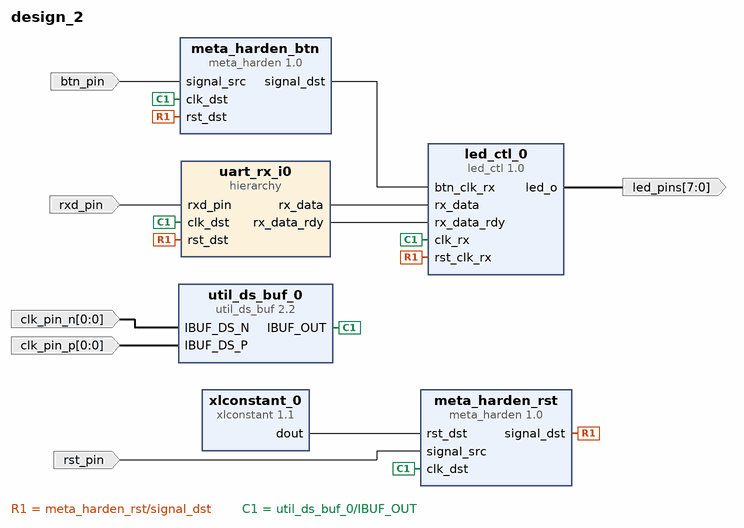
[diagram p0: block diagram of the top level]
# Vivado block design design_2, xcku040-ffva1156-2-e, Vivado 2021.2
create_bd_design design_2

create_bd_port -dir I -from 0 -to 0 -type clk clk_pin_p
create_bd_port -dir I -from 0 -to 0 -type clk clk_pin_n
create_bd_port -dir O -from 7 -to 0 led_pins
create_bd_port -dir I btn_pin
create_bd_port -dir I rst_pin
create_bd_port -dir I rxd_pin

create_bd_cell -type ip -vlnv xilinx.com:user:led_ctl:1.0 led_ctl_0
create_bd_cell -type ip -vlnv xilinx.com:user:meta_harden:1.0 meta_harden_btn
create_bd_cell -type ip -vlnv xilinx.com:user:meta_harden:1.0 meta_harden_rst
create_bd_cell -type ip -vlnv xilinx.com:ip:util_ds_buf:2.2 util_ds_buf_0
create_bd_cell -type hier uart_rx_i0
create_bd_cell -type ip -vlnv xilinx.com:ip:xlconstant:1.1 xlconstant_0
set_property -dict {CONFIG.CONST_VAL 0} [get_bd_cells xlconstant_0]

# ---- hierarchy /uart_rx_i0 ----
current_bd_instance /uart_rx_i0
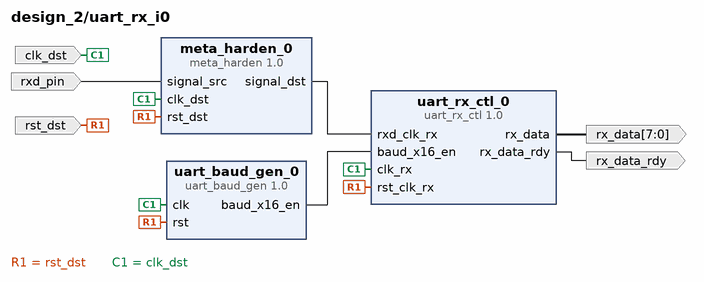
[diagram p1: block diagram inside /uart_rx_i0]
create_bd_pin -dir I clk_dst
create_bd_pin -dir I rst_dst
create_bd_pin -dir O -from 7 -to 0 rx_data
create_bd_pin -dir O rx_data_rdy
create_bd_pin -dir I rxd_pin

create_bd_cell -type ip -vlnv xilinx.com:user:uart_baud_gen:1.0 uart_baud_gen_0
create_bd_cell -type ip -vlnv xilinx.com:user:uart_rx_ctl:1.0 uart_rx_ctl_0
create_bd_cell -type ip -vlnv xilinx.com:user:meta_harden:1.0 meta_harden_0

# ---- connections ----

current_bd_instance /uart_rx_i0
connect_bd_net [get_bd_pins meta_harden_0/signal_dst] [get_bd_pins uart_rx_ctl_0/rxd_clk_rx]
connect_bd_net -net meta_harden_rst_signal_dst [get_bd_pins rst_dst] \
  [get_bd_pins meta_harden_0/rst_dst] [get_bd_pins uart_rx_ctl_0/rst_clk_rx] [get_bd_pins uart_baud_gen_0/rst]
connect_bd_net -net signal_src_0_3 [get_bd_pins rxd_pin] [get_bd_pins meta_harden_0/signal_src]
connect_bd_net [get_bd_pins uart_baud_gen_0/baud_x16_en] [get_bd_pins uart_rx_ctl_0/baud_x16_en]
connect_bd_net [get_bd_pins uart_rx_ctl_0/rx_data] [get_bd_pins rx_data]
connect_bd_net [get_bd_pins uart_rx_ctl_0/rx_data_rdy] [get_bd_pins rx_data_rdy]
connect_bd_net -net util_ds_buf_0_IBUF_OUT [get_bd_pins clk_dst] \
  [get_bd_pins meta_harden_0/clk_dst] [get_bd_pins uart_rx_ctl_0/clk_rx] [get_bd_pins uart_baud_gen_0/clk]

current_bd_instance /
connect_bd_net -net IBUF_DS_N_0_1 [get_bd_ports clk_pin_n] [get_bd_pins util_ds_buf_0/IBUF_DS_N]
connect_bd_net -net IBUF_DS_P_0_1 [get_bd_ports clk_pin_p] [get_bd_pins util_ds_buf_0/IBUF_DS_P]
connect_bd_net [get_bd_pins led_ctl_0/led_o] [get_bd_ports led_pins]
connect_bd_net [get_bd_pins meta_harden_btn/signal_dst] [get_bd_pins led_ctl_0/btn_clk_rx]
connect_bd_net [get_bd_pins meta_harden_rst/signal_dst] \
  [get_bd_pins meta_harden_btn/rst_dst] [get_bd_pins led_ctl_0/rst_clk_rx] [get_bd_pins uart_rx_i0/rst_dst]
connect_bd_net -net signal_src_0_1 [get_bd_ports btn_pin] [get_bd_pins meta_harden_btn/signal_src]
connect_bd_net -net signal_src_0_2 [get_bd_ports rst_pin] [get_bd_pins meta_harden_rst/signal_src]
connect_bd_net -net signal_src_0_3 [get_bd_ports rxd_pin] [get_bd_pins uart_rx_i0/rxd_pin]
connect_bd_net -net uart_rx_ctl_0_rx_data [get_bd_pins uart_rx_i0/rx_data] [get_bd_pins led_ctl_0/rx_data]
connect_bd_net -net uart_rx_ctl_0_rx_data_rdy [get_bd_pins uart_rx_i0/rx_data_rdy] [get_bd_pins led_ctl_0/rx_data_rdy]
connect_bd_net [get_bd_pins util_ds_buf_0/IBUF_OUT] \
  [get_bd_pins led_ctl_0/clk_rx] [get_bd_pins meta_harden_rst/clk_dst] [get_bd_pins meta_harden_btn/clk_dst] \
  [get_bd_pins uart_rx_i0/clk_dst]
connect_bd_net [get_bd_pins xlconstant_0/dout] [get_bd_pins meta_harden_rst/rst_dst]

set_property USER_COMMENTS.comment_0 {This is an IPI example project. This is to demonstrate that the IP integrator flow (IPI 
flow) can also be used for non-embedded designs.} [current_bd_design]

validate_bd_design
save_bd_design
